# EAGLE design 555 (EAGLE 9.0.1)
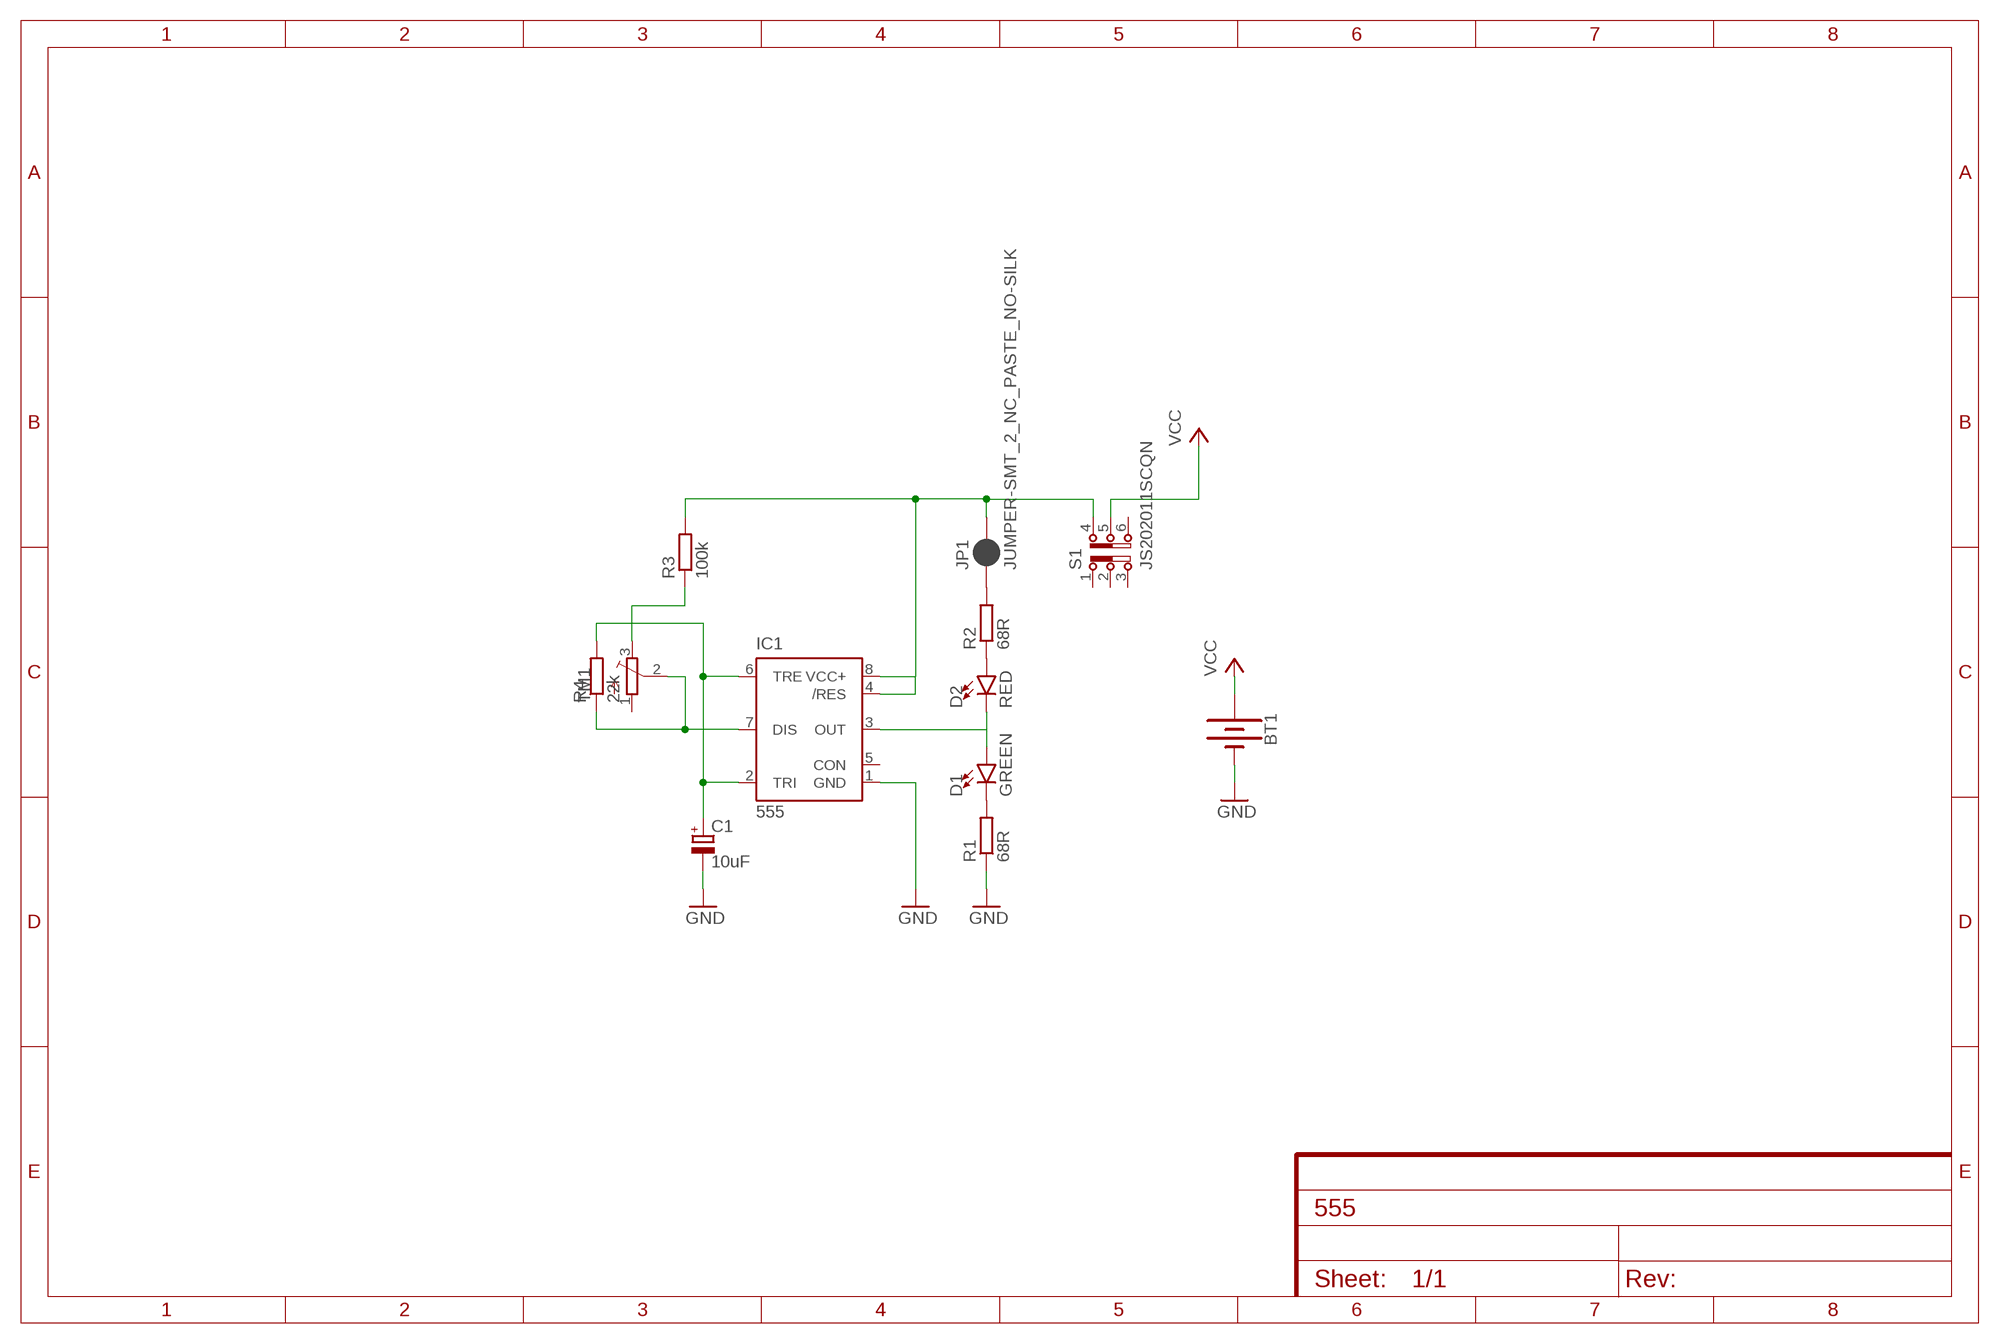
[diagram p0: schematic, sheet 1]

## Parts
BT1  BATTERY-20MM_SMD  [BATTCON_20MM]
C1  10uF  CPOL-EUSMCA  [SMC_A]
D1  GREEN  LED-GREEN1206  [LED-1206]
D2  RED  LED1206  [LED-1206]
IC1  555  555D  [SO08]
JP1  JUMPER-SMT_2_NC_PASTE_NO-SILK  [SMT-JUMPER_2_NC_PASTE_NO-SILK]
R1  68R  R-EU_R0603  [R0603]
R2  68R  R-EU_R0603  [R0603]
R3  100k  R-EU_R0603  [R0603]
R4  22k  R-EU_R0603  [R0603]
S1  JS202011SCQN  [JS202011SCQN]
TM1  TRIMPOTTC33X  [TC33X]

## Nets
GND: BT1.2(-) C1.- IC1.1(GND) R1.1
N$1: C1.+ IC1.2(TRI) IC1.6(TRE) R4.2
N$2: IC1.4(/RES) IC1.8(VCC+) JP1.2 R3.2 S1.4
N$3: IC1.7(DIS) R4.1 TM1.2(S)
N$4: D1.C R1.2
N$5: D1.A D2.C IC1.3(OUT)
N$6: D2.A R2.1
N$7: JP1.1 R2.2
N$8: R3.1 TM1.3(E)
VCC: BT1.1(+) S1.5
Unconnected: IC1.5(CON) S1.1 S1.2 S1.3 S1.6 TM1.1(A)

## Library data of the parts
BT1 = SparkFun-Batteries:BATTERY: Battery - Single Cell A variety of battery chemistries, sizes, and footprints. Device List: 20MM_PTH - Coin Cell Battery Holder - 20mm (PTH) <https://www.sparkfun.com/products/783> 6.8MM_PTH - Coin Cell Battery Holder - 6.8MM(SMD) <https://www.digikey.com/product-detail/en/seiko-instruments/MS621FE-FL11E/728-1057-ND/1889208?WT.srch=1&gclid=CNOQ5a6LzdQCFZS2wAodXCkE0g> 12MM_SMD - Coin Cell Battery Holder - 12mm (SMD) <https://www.sparkfun.com/products/10592> 12MM_PTH - Coin Cell Battery Holder - 12mm (PTH) <https://www.sparkfun.com/products/7948> 20MM_SMD - 20mm Coin Cell Battery Holder (SMD) (2 legs) Used on the Big Time Watch Kit <https://www.sparkfun.com/products/11734> 20MM_SMD_4LEGS - Coin Cell Battery Holder - 20mm (SMD) <https://www.sparkfun.com/products/11892> 20MM_SMD_4LEGS_OVERPASTE - Coin Cell Battery Holder - 20mm (SMD) <https://www.sparkfun.com/products/11892> (Over-paste on the legs) 24.5MM_PTH - Coin Cell Battery Holder - 24.5mm (PTH) <https://www.sparkfun.com/products/8863> 9V - 9V Battery Holder - PC Mount Used on the SparkFun SparkPunk Sound Kit <https://www.sparkfun.com/products/11177> and SparkFun SparkPunk Sequencer Kit <https://www.sparkfun.com/products/12707> 18650 - Battery Holder - 18650 (PTH) <https://www.sparkfun.com/products/13113> AA - Battery Holder - 1xAA (PTH) <https://www.sparkfun.com/products/7949> AAA - Battery Holder - 1xAAA (PTH) <https://www.sparkfun.com/products/12718> AA_KIT - Battery Holder - 1xAA (PTH) <https://www.sparkfun.com/products/7949> Special kit package - pads only have exposed copper on one side of the board. AAA_KIT - Battery Holder - 1xAAA (PTH) <https://www.sparkfun.com/products/12718> Special kit package - pads only have exposed copper on one side of the board.; PROD_ID: BATT-11519
C1 = resistor:CPOL-EU: POLARIZED CAPACITOR, European symbol
D1 = SparkFun-LED:LED-GREEN: Green SMD LED Used in manufacturing of various products at SparkFun Packages: 0603 - SMD 0603 package [Product Link] <http://www.futureelectronics.com/en/technologies/semiconductors/optoelectronics/leds/Pages/9894312-LTST-C190GKT.aspx?CrossPart=HSMG-C190&IM=0> LilyPad 1206 - SMD1206 LilyPad package [Product Link] <http://www.futureelectronics.com/en/Technologies/Product.aspx?ProductID=IN150NGHARVATEKCORPORATION2049943&IM=0> 1206 - SMD1206 package [Product Link] <http://www.futureelectronics.com/en/technologies/semiconductors/optoelectronics/leds/Pages/8315665-LTST-C150KGKT.aspx?IM=0> 1206 Bottom Mount -SMD 1206 Bottom Mount [Product Link] <http://www.digikey.com/product-detail/en/lite-on-inc/LTST-C230KGKT/160-1456-1-ND/386854> SparkFun Products: Pro Mini 328 -5V <https://www.sparkfun.com/products/821> RedBoard <https://www.sparkfun.com/products/12757> MP3 Trigger <https://www.sparkfun.com/products/13720> Makey Makey <https://www.sparkfun.com/products/11076>; PROD_ID: DIO-00862
D2 = SparkFun-LED:LED: LED (Generic) Standard schematic elements and footprints for 5mm, 3mm, 1206, and 0603 sized LEDs. Generic LEDs with no color specified.
IC1 = SparkFun-IC-Special-Function:555: General purpose bipolar Timer Datasheet <http://www.sparkfun.com/datasheets/Components/General/ne555.pdf> SparkFun Products SparkFun SparkPunk Sequencer Kit <https://www.sparkfun.com/products/12707> (KIT-12707) Storefront Component: 555 Timer <https://www.sparkfun.com/products/9273> (COM-09273) Two parts valid for production: VFP: IC-11930 (M7555 PTH) VFP: IC-09173 (555 PTH) - Preferred; PROD_ID: NA-XXXXX
JP1 = SparkFun-Jumpers:JUMPER-SMT_2_NC_PASTE: Normally closed solder jumper This jumper has an aperture in the stencil to allow solder paste to bridge the split in the wire so it's normally closed (NC). Wick off the solder to open the connection. Reapply solder to reclose the connection.
R1-R4 = resistor:R-EU_: RESISTOR, European symbol
S1 = slide:JS202011SCQN: DPDT SLIDE SWITCH
TM1 = adafruit:TRIMPOT: SMT trimmer potentiometer part number TC33X http://www.ladyada.net/library/eagle

## Board
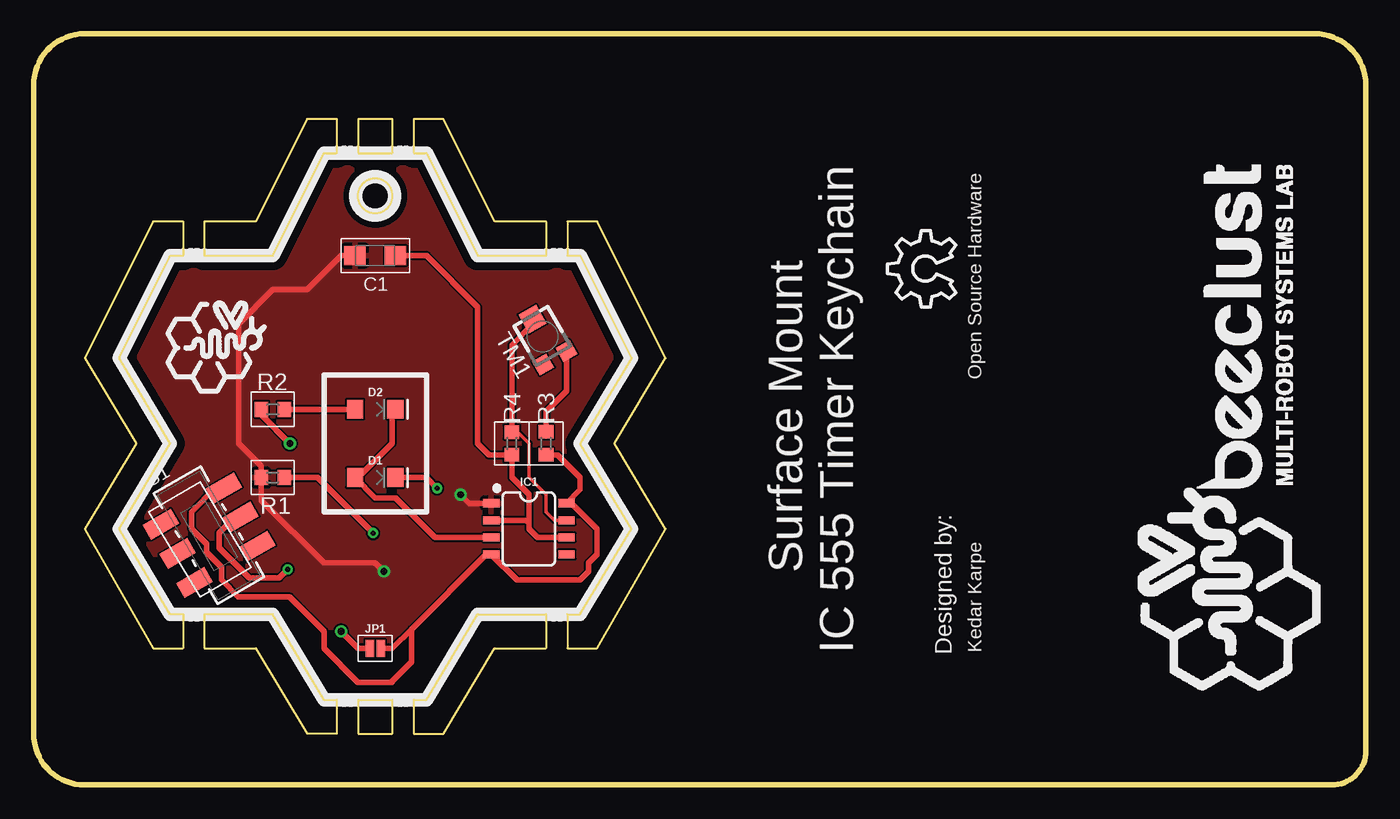
[diagram p1: board, top side]
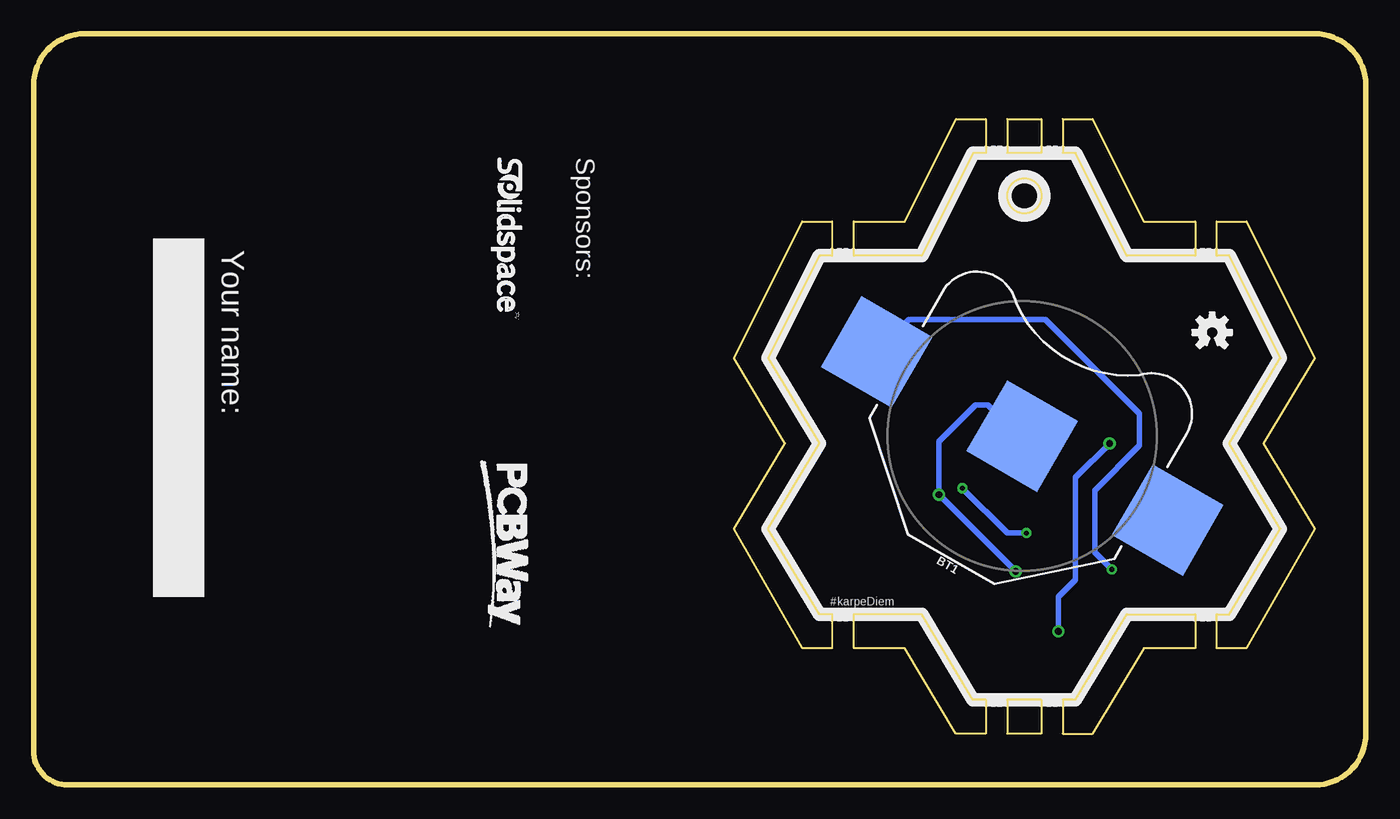
[diagram p2: board, bottom side, seen from below]

Size 99.06 x 55.88 mm. Coordinates in mm from the lower left corner, seen from the top.
Outline: 29.21,6.35 33.02,12.7 38.1,12.7 38.1,10.16 34.29,10.16 30.48,3.81 28.26,3.81 28.26,6.35 29.21,6.35
Outline: 21.59,6.35 17.78,12.7 12.7,12.7 12.7,10.16 16.51,10.16 20.32,3.81 22.54,3.81 22.54,6.35 21.59,6.35
Outline: 39.69,12.7 40.64,12.7 44.45,19.05 40.64,25.4 44.45,31.75 40.64,39.37 39.69,39.37 39.69,41.91 41.91,41.91 46.99,31.75 43.18,25.4 46.99,19.05 41.91,10.16 39.69,10.16 39.69,12.7
Outline: 11.11,12.7 10.16,12.7 6.35,19.05 10.16,25.4 6.35,31.75 10.16,39.37 11.11,39.37 11.11,41.91 8.89,41.91 3.81,31.75 7.62,25.4 3.81,19.05 8.89,10.16 11.11,10.16 11.11,12.7
Outline: 12.7,39.37 17.78,39.37 21.59,46.99 22.54,46.99 22.54,49.53 20.32,49.53 16.51,41.91 12.7,41.91 12.7,39.37
Outline: 29.21,46.99 33.02,39.37 38.1,39.37 38.1,41.91 34.29,41.91 30.48,49.53 28.26,49.53 28.26,46.99 29.21,46.99
Outline: 26.67,49.53 24.13,49.53 24.13,46.99 26.67,46.99 26.67,49.53
Outline: 24.13,6.35 26.67,6.35 26.67,3.81 24.13,3.81 24.13,6.35
Outline: 0,3.81 arc90 3.81,0 5.08,0 96.52,0 arc90 99.06,2.54 99.06,52.07 arc90 95.25,55.88 3.81,55.88 arc90 0,52.07 0,3.81
Outline: circle at 25.4,43.81 radius 1.27
Copper layers (1*16): Top 0.035mm / dielectric 1.5mm / Bottom 0.035mm
Design rules "default": minimum track width 6mil, minimum drill 0.35mm, track to track 6mil, track to pad 6mil, pad to pad 6mil, via to via 6mil, smd to smd 6mil, copper to edge 40mil, drill to drill 6mil, minimum pad ring 10mil, minimum via ring 8mil, stop-mask expansion 4mil, vias tented up to drill 0mil, thermal gap 10mil
Holes 0.35 mm at 22.54,6.03 24.13,6.03 23.5,6.03 23.18,6.03 26.67,6.03 28.26,6.03 27.62,6.03 27.3,6.03 38.1,12.38 39.69,12.38 39.05,12.38 38.73,12.38 38.1,39.69 39.69,39.69 39.05,39.69 38.73,39.69 28.26,47.31 26.67,47.31 27.3,47.31 27.62,47.31 24.13,47.31 22.54,47.31 23.18,47.31 23.5,47.31 12.7,39.69 11.11,39.69 12.06,39.69 11.75,39.69 11.11,12.38 12.7,12.38 12.06,12.38 11.75,12.38 11.59,12.38 12.22,12.38 23.02,6.03 23.65,6.03 27.15,6.03 27.78,6.03 38.58,12.38 39.21,12.38 39.21,39.69 38.58,39.69 27.78,47.31 27.15,47.31 23.65,47.31 23.02,47.31 12.22,39.69 11.59,39.69

### Footprints (pad centres in the part's own frame; a part is rotated, then mirrored left to right if it is on the bottom)
BATTCON_20MM = smd 6.07 x 6.07: 1 -12.5,0; 2 0,0; 3 12.5,0
SMC_A = smd 1.6 x 1.4: + -1.5,0; - 1.5,0
LED-1206 = smd 1.2 x 1.4: A -1.5,0; C 1.5,0
SO08 = smd 0.6 x 1.2: 1 -1.905,-2.8; 2 -0.635,-2.8; 3 0.635,-2.8; 4 1.905,-2.8; 5 1.905,2.8; 6 0.635,2.8; 7 -0.635,2.8; 8 -1.905,2.8
SMT-JUMPER_2_NC_PASTE_NO-SILK = smd 0.635 x 1.27: 1 -0.406,0; 2 0.406,0
R0603 = smd 1 x 1.1: 1 -0.85,0; 2 0.85,0
JS202011SCQN = smd 1.27 x 2.4: 1 -2.5,-2.7; 2 0,-2.7; 3 2.5,-2.7; 4 -2.5,2.7; 5 0,2.7; 6 2.5,2.7
TC33X = smd 1.2 x 1.2: 1 -1,-1.825; 3 1,-1.825 | smd 1.5 x 1.6: 2 0,1.5

### Placement (x,y rotation side)
BT1  25.56,25.95 330 bottom
C1  25.4,39.37 180 top
D1  25.4,22.86 0 top
D2  25.4,27.94 0 top
IC1  36.83,19.05 270 top
JP1  25.4,10.16 0 top
R1  17.78,22.86 0 top
R2  17.79,27.93 180 top
R3  38.1,25.4 270 top
R4  35.56,25.4 270 top
S1  13.05,18.57 300 top
TM1  37.84,33.35 30 top
U$2  [LOGO-L]  96.52,6.35 90 top
U$3  [OSHW_10X200_NOTEXT]  68.58,35.56 90 top
U$4  [LOGO-NONAME]  8.89,27.94 0 top
U$5  [OSHW-LOGO-S]  11.43,33.66 0 bottom
U$6  [PCBWAYLOGO-M]  68.9,24.77 270 bottom
U$7  [SOLIDSPACELOGO-M]  65.09,46.67 270 bottom

### Tracks (layer width: path | path; a pad name or v marks a point on that pad's centre or on a via)
GND  (via drill 0.5 pad 0.9)
  Top 0.406: C1.- 22.86,39.37 20.32,36.83 17.78,36.83 15.24,34.29 15.24,25.4 16.93,23.71 R1.1 16.93,21.17 21.59,16.51 25.4,16.51 v26.04,15.88 | IC1.1 32.38,20.95 v31.75,21.59
  Bottom 0.406: v26.04,15.88 v31.75,21.59 31.75,25.56 29.05,28.26 28.1,28.26 25.79,25.95 BT1.2
  pour Top: 6.35,31.75 10.16,39.37 17.78,39.37 21.59,46.99 29.21,46.99 33.02,39.37 40.64,39.37 44.45,31.75 40.64,25.4 44.45,19.05 40.64,12.7 33.02,12.7 29.21,6.35 21.59,6.35 17.78,12.7 10.16,12.7 6.35,19.05 10.16,25.4
N$1
  Top 0.406: IC1.6 37.47,18.41 36.83,19.05 36.83,19.5 | 36.83,19.5 36.83,21.59 35.56,22.86 R4.2 33.87,24.55 33.02,25.4 33.02,35.56 29.21,39.37 C1.+ | IC1.2 36.65,19.68 36.83,19.5
N$2
  Top 0.406: 28.1,11.59 26.67,10.16 JP1.2 | 28.1,11.59 33.66,17.14 IC1.4 35.94,15.24 40.64,15.24 41.27,15.88 41.27,16.51 41.91,17.14 41.91,19.05 40.01,20.95 IC1.8 40.64,21.96 40.64,22.86 38.95,24.55 R3.2 | 26.59,7.64 24.11,7.64 21.59,10.16 21.59,11.43 19.02,13.99 15.21,13.99 13.97,15.24 13.97,16.19 12.86,17.3 12.86,17.94 11.75,19.05 11.75,20.32 13.52,22.09 S1.4 | 26.59,7.64 26.67,7.64 | 28.1,11.59 28.1,9.16 26.59,7.64
N$3
  Top 0.254: R4.1 35.98,26.25 36.83,25.4 36.83,22.86 38.1,21.59 38.1,20.32 38.73,19.68 IC1.7
  Top 0.406: R4.1 35.56,32.73 37.09,34.27 TM1.2
N$4  (via drill 0.35)
  Top 0.406: R1.2 21.11,22.86 v25.24,18.73 | D1.C 29.21,22.86 v30,22.07
  Bottom 0.406: v25.24,18.73 26.67,18.73 v30,22.07
N$5
  Top 0.406: 28.18,20.07 29.84,18.41 IC1.3 | 28.18,20.07 27.94,20.32 | D2.C 26.67,27.71 26.67,25.4 24.13,22.86 D1.A 25.4,21.36 26.9,21.36 28.18,20.07
N$6
  Top 0.406: D2.A R2.1
N$7  (via drill 0.5 pad 0.9)
  Top 0.406: R2.2 16.94,27.51 v19.05,25.4 | v22.86,11.43 24.13,10.16 JP1.1
  Bottom 0.406: v19.05,25.4 21.59,22.86 21.59,15.24 22.86,13.97 v22.86,11.43
N$8
  Top 0.406: TM1.3 39.62,29.3 38.1,27.78 R3.1 | R3.1
VCC  (via drill 0.35)
  Top 0.406: S1.5 15,19.92 13.81,18.73 13.81,17.62 16.03,15.4 18.26,15.4 v18.89,16.03
  Bottom 0.406: v18.89,16.03 20.16,17.3 20.16,21.91 16.83,25.24 16.83,27.62 23.81,34.61 33.98,34.61 BT1.1

### Text on the board
tNames: Open Source Hardware | Surface Mount / IC 555 Timer Keychain | Designed by: | Kedar Karpe
bNames: Sponsors: | Your name: | #karpeDiem